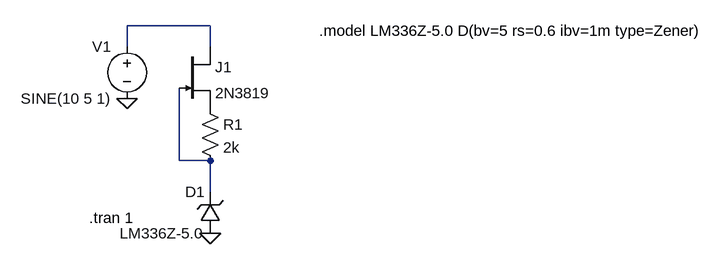
[diagram p0: schematic lm336z.asc]
lm336z.asc, the LTspice schematic file:
Version 4
SHEET 1 1004 680
WIRE 128 80 0 80
WIRE 0 112 0 80
WIRE 128 112 128 80
WIRE 80 288 80 176
WIRE 128 288 80 288
WIRE 128 336 128 288
FLAG 0 192 0
FLAG 128 400 0
SYMBOL voltage 0 96 M0
WINDOW 123 0 0 Left 2
WINDOW 39 0 0 Left 2
SYMATTR InstName V1
SYMATTR Value SINE(10 5 1)
SYMBOL zener 144 400 R180
WINDOW 0 24 64 Left 2
WINDOW 3 24 0 Left 2
SYMATTR InstName D1
SYMATTR Value LM336Z-5.0
SYMATTR Description Diode
SYMATTR Type diode
SYMBOL njf 80 112 R0
SYMATTR InstName J1
SYMATTR Value 2N3819
SYMBOL res 112 192 R0
SYMATTR InstName R1
SYMATTR Value 2k
TEXT 296 88 Left 2 !.model LM336Z-5.0 D(bv=5 rs=0.6 ibv=1m type=Zener)
TEXT -58 376 Left 2 !.tran 1

The netlist it stands for:
* lm336z.asc
V1 N001 0 SINE(10 5 1)
D1 0 N002 LM336Z-5.0
J1 N001 N002 P001 2N3819
R1 P001 N002 2k
.model D D
.lib standard.dio
.model NJF NJF
.model PJF PJF
.lib standard.jft
.model LM336Z-5.0 D(bv=5 rs=0.6 ibv=1m type=Zener)
.tran 1
.backanno
.end